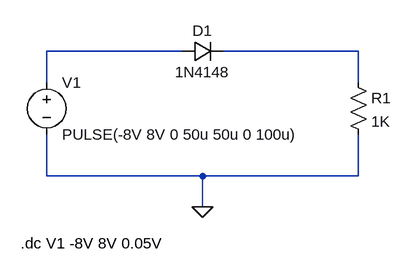
[diagram p0: schematic 1.1.2.asc]
1.1.2.asc, the LTspice schematic file:
Version 4
SHEET 1 880 680
WIRE 256 64 48 64
WIRE 528 64 320 64
WIRE 48 112 48 64
WIRE 528 112 528 64
WIRE 48 256 48 192
WIRE 288 256 48 256
WIRE 528 256 528 192
WIRE 528 256 288 256
WIRE 288 304 288 256
FLAG 288 304 0
SYMBOL voltage 48 96 R0
WINDOW 123 0 0 Left 0
WINDOW 39 0 0 Left 0
SYMATTR InstName V1
SYMATTR Value PULSE(-8V 8V 0 50u 50u 0 100u)
SYMBOL res 512 96 R0
SYMATTR InstName R1
SYMATTR Value 1K
SYMBOL diode 256 80 R270
WINDOW 0 32 32 VTop 2
WINDOW 3 0 32 VBottom 2
SYMATTR InstName D1
SYMATTR Value 1N4148
TEXT 8 360 Left 2 !.dc V1 -8V 8V 0.05V

The netlist it stands for:
* 1.1.2.asc
V1 N001 0 PULSE(-8V 8V 0 50u 50u 0 100u)
R1 N002 0 1K
D1 N001 N002 1N4148
.model D D
.lib standard.dio
.dc V1 -8V 8V 0.05V
.backanno
.end